# Altium project ip_phone.PrjPcb (part 2 of 2)

## Sheet ip_phone_f_power.SchDoc: Carregador e Fontes
size A3; SheetNumber: 6; SheetTotal: 6
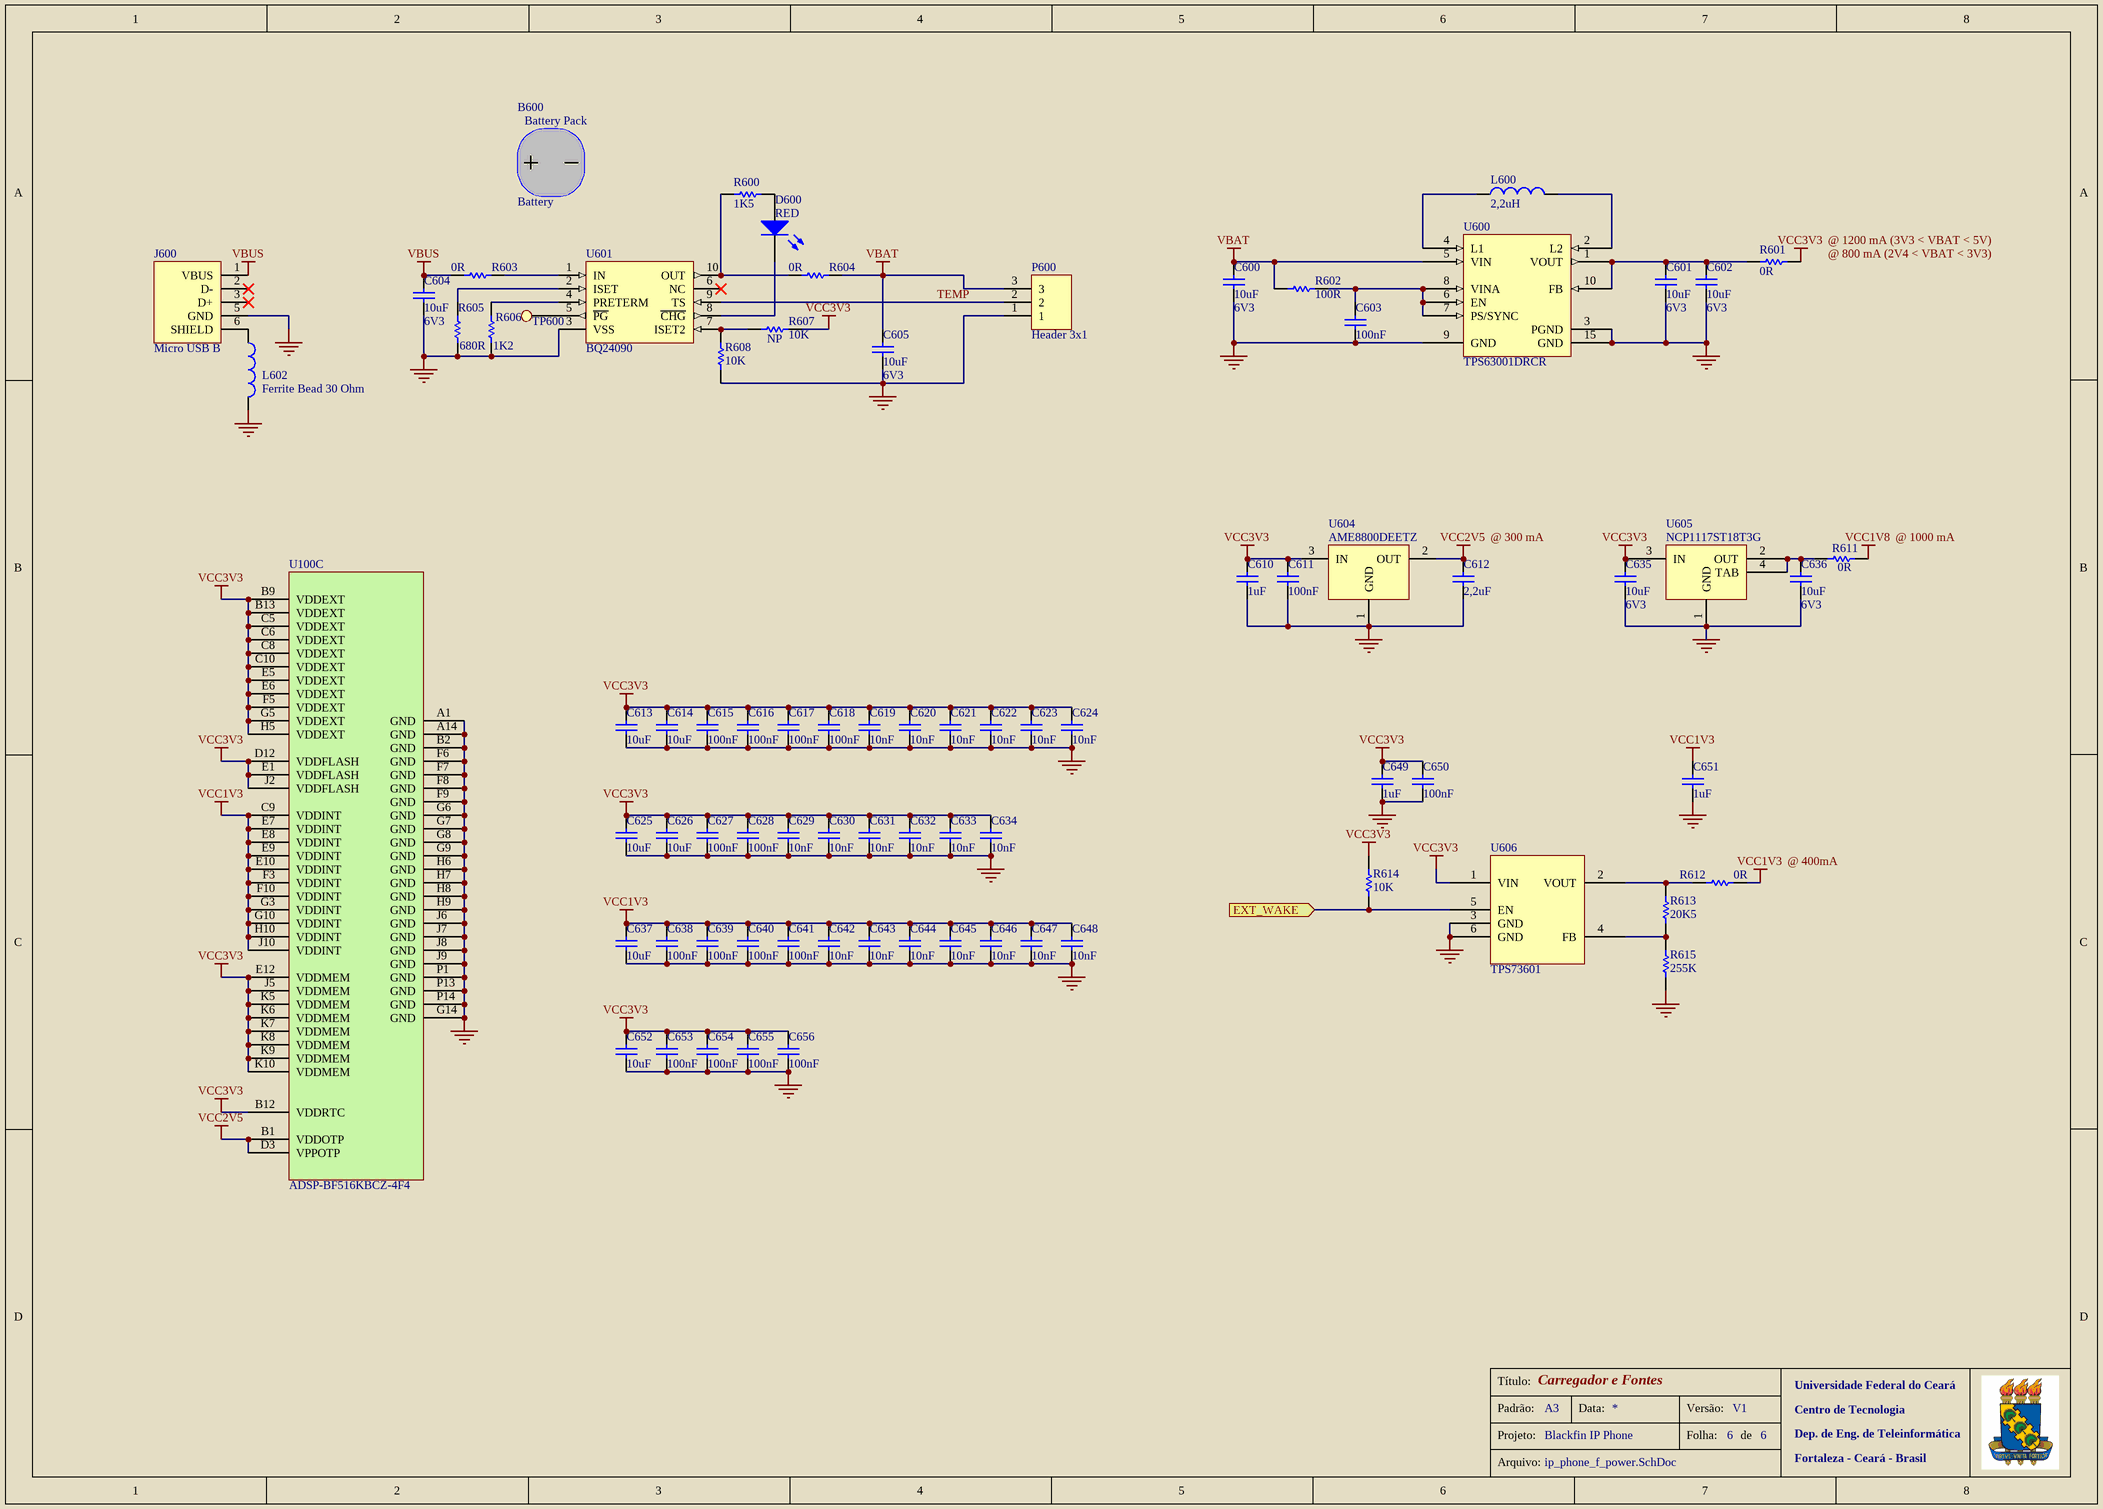
[diagram p5: ip_phone_f_power.SchDoc]

### Parts
B600  Battery  (mechanical)
C600  10uF  [CC1608-0603]
C601  10uF  [CC1608-0603]
C602  10uF  [CC1608-0603]
C603  100nF  [CC1005-0402]
C604  10uF  [CC1608-0603]
C605  10uF  [CC1608-0603]
C610  1uF  [CC1005-0402]
C611  100nF  [CC1005-0402]
C612  2,2uF  [CC1608-0603]
C613  10uF  [CC1608-0603]
C614  10uF  [CC1608-0603]
C615  100nF  [CC1005-0402]
C616  100nF  [CC1005-0402]
C617  100nF  [CC1005-0402]
C618  100nF  [CC1005-0402]
C619  10nF  [CC1005-0402]
C620  10nF  [CC1005-0402]
C621  10nF  [CC1005-0402]
C622  10nF  [CC1005-0402]
C623  10nF  [CC1005-0402]
C624  10nF  [CC1005-0402]
C625  10uF  [CC1608-0603]
C626  10uF  [CC1608-0603]
C627  100nF  [CC1005-0402]
C628  100nF  [CC1005-0402]
C629  10nF  [CC1005-0402]
C630  10nF  [CC1005-0402]
C631  10nF  [CC1005-0402]
C632  10nF  [CC1005-0402]
C633  10nF  [CC1005-0402]
C634  10nF  [CC1005-0402]
C635  10uF  [CC1608-0603]
C636  10uF  [CC1608-0603]
C637  10uF  [CC1608-0603]
C638  100nF  [CC1005-0402]
C639  100nF  [CC1005-0402]
C640  100nF  [CC1005-0402]
C641  100nF  [CC1005-0402]
C642  10nF  [CC1005-0402]
C643  10nF  [CC1005-0402]
C644  10nF  [CC1005-0402]
C645  10nF  [CC1005-0402]
C646  10nF  [CC1005-0402]
C647  10nF  [CC1005-0402]
C648  10nF  [CC1005-0402]
C649  1uF  [CC1005-0402]
C650  100nF  [CC1005-0402]
C651  1uF  [CC1005-0402]
C652  10uF  [CC1608-0603]
C653  100nF  [CC1005-0402]
C654  100nF  [CC1005-0402]
C655  100nF  [CC1005-0402]
C656  100nF  [CC1005-0402]
D600  RED  [LED_0603]
J600  Micro USB B  [Micro USB]
L600  2,2uH  [POWER INDUCTOR]
L602  Ferrite Bead 30 Ohm  [INDUTOR_0603]
P600  Header 3x1  [HEADER 3x1]
R600  1K5  [CR1608-0603]
R601  0R  [CR3225-1210]
R602  100R  [CR1608-0603]
R603  0R  [CR1608-0603]
R604  0R  [CR1608-0603]
R605  680R  [CR1005-0402]
R606  1K2  [CR1005-0402]
R607  10K  [CR1005-0402]
R608  10K  [CR1005-0402]
R611  0R  [CR3225-1210]
R612  0R  [CR1608-0603]
R613  20K5  [CR1005-0402]
R614  10K  [CR1005-0402]
R615  255K  [CR1005-0402]
TP600  Test Point  [Test Point]  (value not drawn)  (no BOM)
U100  ADSP-BF516KBCZ-4F4  [BGA168]  (part C of 3)
U600  TPS63001DRCR  [SON10]
U601  BQ24090  [MSOP10]
U604  AME8800DEETZ  [SOT-23]
U605  NCP1117ST18T3G  [SOT223]
U606  TPS73601  [SOT223 - 6P]

### Ports
EXT_WAKE (in)

### Nets
GND: C600.1 C601.1 C602.1 C603.1 C604.1 C605.1 C610.2 C611.1 C612.1 C613.1 C614.1 C615.1 C616.1 C617.1 C618.1 C619.1 C620.1 C621.1 C622.1 C623.1 C624.1 C625.1 C626.1 C627.1 C628.1 C629.1 C630.1 C631.1 C632.1 C633.1 C634.1 C635.1 C636.1 C637.1 C638.1 C639.1 C640.1 C641.1 C642.1 C643.1 C644.1 C645.1 C646.1 C647.1 C648.1 C649.2 C650.1 C651.2 C652.1 C653.1 C654.1 C655.1 C656.1 J600.5(GND) L602.2 P600.1 R605.1 R606.2 R608.2 R615.1 U100.A1(GND) U100.A14(GND) U100.B2(GND) U100.F6(GND) U100.F7(GND) U100.F8(GND) U100.F9(GND) U100.G6(GND) U100.G7(GND) U100.G8(GND) U100.G9(GND) U100.G14(GND) U100.H6(GND) U100.H7(GND) U100.H8(GND) U100.H9(GND) U100.J6(GND) U100.J7(GND) U100.J8(GND) U100.J9(GND) U100.P1(GND) U100.P13(GND) U100.P14(GND) U600.3(PGND) U600.9(GND) U600.15(GND) U601.3(VSS) U604.1(GND) U605.1(GND) U606.3(GND) U606.6(GND)  [project net AGND]
VBAT: C600.2 C605.2 P600.3 R602.2 R604.1 U600.5(VIN)
VBUS: C604.2 J600.1(VBUS) R603.2
VCC1V3: C637.2 C638.2 C639.2 C640.2 C641.2 C642.2 C643.2 C644.2 C645.2 C646.2 C647.2 C648.2 C651.1 R612.1 U100.C9(VDDINT) U100.E7(VDDINT) U100.E8(VDDINT) U100.E9(VDDINT) U100.E10(VDDINT) U100.F3(VDDINT) U100.F10(VDDINT) U100.G3(VDDINT) U100.G10(VDDINT) U100.H10(VDDINT) U100.J10(VDDINT)
VCC1V8: R611.2
VCC2V5: C612.2 U100.B1(VDDOTP) U100.D3(VPPOTP) U604.2(OUT)
VCC3V3: C610.1 C611.2 C613.2 C614.2 C615.2 C616.2 C617.2 C618.2 C619.2 C620.2 C621.2 C622.2 C623.2 C624.2 C625.2 C626.2 C627.2 C628.2 C629.2 C630.2 C631.2 C632.2 C633.2 C634.2 C635.2 C649.1 C650.2 C652.2 C653.2 C654.2 C655.2 C656.2 R601.2 R607.1 R614.1 U100.B9(VDDEXT) U100.B12(VDDRTC) U100.B13(VDDEXT) U100.C5(VDDEXT) U100.C6(VDDEXT) U100.C8(VDDEXT) U100.C10(VDDEXT) U100.D12(VDDFLASH) U100.E1(VDDFLASH) U100.E5(VDDEXT) U100.E6(VDDEXT) U100.E12(VDDMEM) U100.F5(VDDEXT) U100.G5(VDDEXT) U100.H5(VDDEXT) U100.J2(VDDFLASH) U100.J5(VDDMEM) U100.K5(VDDMEM) U100.K6(VDDMEM) U100.K7(VDDMEM) U100.K8(VDDMEM) U100.K9(VDDMEM) U100.K10(VDDMEM) U604.3(IN) U605.3(IN) U606.1(VIN)
EXT_WAKE: R614.2 U606.5(EN) ; port EXT_WAKE
TEMP: P600.2 U601.9(TS)
NetC601_2: C601.2 C602.2 R601.1 U600.1(VOUT) U600.10(FB)
NetC603_2: C603.2 R602.1 U600.6(EN) U600.7(PS/SYNC) U600.8(VINA)
NetC636_2: C636.2 R611.1 U605.2(OUT) U605.4(TAB)
NetD600_1: D600.1(A) R600.1
NetD600_2: D600.2(K) U601.8(~{CHG})
NetJ600_6: J600.6(SHIELD) L602.1
NetL600_1: L600.1 U600.4(L1)
NetL600_2: L600.2 U600.2(L2)
NetR600_2: R600.2 R604.2 U601.10(OUT)
NetR603_1: R603.1 U601.1(IN)
NetR605_2: R605.2 U601.2(ISET)
NetR606_1: R606.1 U601.4(PRETERM)
NetR607_2: R607.2 R608.1 U601.7(ISET2)
NetR612_2: R612.2 R613.2 U606.2(VOUT)
NetR613_1: R613.1 R615.2 U606.4(FB)
NetTP600_1: TP600.1 U601.5(~{PG})

Not connected (* = marked no-connect by the designer): J600 2(D-)* 3(D+)*; U601 6(NC)*

### Notes on the sheet
- (near R601) @ 1200 mA (3V3 < VBAT < 5V)
- (near C600) 6V3
- (near C601) 6V3
- (near C602) 6V3
- (near R601) @ 800 mA (2V4 < VBAT < 3V3)
- 6V3
- (near C605) 6V3
- (near C612) @ 300 mA
- (near R611) @ 1000 mA
- (near C636) 6V3
- @ 400mA
- Título:
- Universidade Federal do Ceará
- Padrão:
- Projeto:
- A3
- Blackfin IP Phone
- Data:
- Versão:
- Folha:
- V1
- de
- Centro de Tecnologia
- Dep. de Eng. de Teleinformática
- Fortaleza - Ceará - Brasil
- Arquivo:
- (in symbol Battery) Battery Pack

### Library data of the parts
B600 = Battery: Li-Polymer battery PL714065, 3.7V 2000mAh cell; eVendorPart#: PC-714065; eVendor: HOLY TECHNOLOGY; eVendorPrice: 3,51; MSRP: 3,05; Manufacturer: HOLY TECHNOLOGY; MOQ: 1000; Part#: PC-714065
C600-C602 C604 C605 C613 C614 C625 C626 C635-C637 C652 = Capacitor: Capacitor SMD/SMT 0603 10uF 6.3volts X5R 20%; eVendorPart#: 810-C2012Y5V1A106Z; Manufacturer: TDK; Part#: C2012Y5V1A106ZT; eVendor: Mouser; eVendorPrice: 0,14; MSRP: 0,033; MOQ: 1000
C603 C611 C615-C618 C627 C628 C638-C641 C650 C653-C656 = Capacitor: MLCC - SMD/SMT 0.1UF 16V 10% 0402; eVendorPart#: 810-C1005X7R1C104K; Manufacturer: TDK; Part#: C1005X7R1C104KT; eVendor: Mouser; eVendorPrice: 0,03; MSRP: 0,005; MOQ: 1000
C610 C649 C651 = Capacitor: CAP CER 1.0UF 6.3V 20% X5R 0402; eVendorPart#: 490-1319-1-ND; Manufacturer: Murata Electronics North America; Part#: GRM155R60J105ME19D; eVendor: Digikey; eVendorPrice: 0,055; MSRP: 0,01193; MOQ: 1000
C612 = Capacitor: Capacitor SMD/SMT 0603 2.2uF 10volts Y5V +80-20%; eVendorPart#: 81-GRM188F51A225ZE01; Manufacturer: Murata; Part#: GRM188F51A225ZE01D; eVendor: Mouser; eVendorPrice: 0,17; MSRP: 0,04; MOQ: 1000
C619-C624 C629-C634 C642-C648 = Capacitor: Capacitor SMD/SMT 0402 0.01uF 16volts X7R 10%; eVendorPart#: 810-C1005X7R1C103K; Manufacturer: TDK; Part#: C1005X7R1C103KT; eVendor: Mouser; eVendorPrice: 0,03; MSRP: 0,004; MOQ: 1000
D600 = LED: Part#: APT1608SURCK; Manufacturer: Kingbright; eVendorPart#: 604-APT1608SURCK; eVendor: Mouser; eVendorPrice: 0,16; MSRP: 0,06; MOQ: 1000
J600 = CON_Micro_USB: USB Connectors 5P Quick Connect Micro USB TypeB Rcpt; Manufacturer: FCI; Part#: 10103594-0001LF; eVendorPart#: 649-10103594-0001LF; eVendor: Mouser; eVendorPrice: 0,45; MSRP: 0,306; MOQ: 1000
L600 = Inductor: IND POWER 2.2UH 1.5A SMD; eVendorPart#: 445-3233-1-ND; Manufacturer: TDK; Part#: VLF4012AT-2R2M1R5; eVendor: Digikey; eVendorPrice: 0,77; MSRP: 0,495; MOQ: 500
L602 = Inductor: EMI/RFI Suppressors & Ferrites 0603 30 OHM; eVendorPart#: 81-BLM11P300S; Manufacturer: Murata; Part#: BLM18PG300SN1D; eVendor: Mouser; eVendorPrice: 0,19; MSRP: 0,041; MOQ: 1000
P600 = CON_HEADER_3x1: CONN HEADER 3POS 2.5MM R/A SMD; Manufacturer: JST Sales America Inc; Part#: S3B-XH-SM4-TB(LF)(SN); eVendorPart#: 455-2263-1-ND; eVendor: Digikey; eVendorPrice: 0,67; MSRP: 0,5125; MOQ: 100
R600 = Resistor: Thick Film Resistors 1.5KOHM 5% 1/10W; eVendorPart#: 52-CR0603-JW-152GLF; Manufacturer: Bourns; Part#: CR0603-JW-152GLF; eVendor: Mouser; eVendorPrice: 0,02; MSRP: 0,008; MOQ: 1000
R601 R611 = Resistor: Thick Film Resistors ZERO OHM JUMPER 1210; eVendorPart#: 660-RK73Z2ETTD; Manufacturer: KOA Speer; Part#: RK73Z2ETTD; eVendor: Mouser; eVendorPrice: 0,14; MSRP: 0,08; MOQ: 1000
R602 = Resistor: Thick Film Resistors 1/16WATT 100R 0402; eVendorPart#: 652-CR0603-JW-101GLF; Manufacturer: Bourns; Part#: CR0603-JW-101GLF; eVendor: Mouser; eVendorPrice: 0,06; MSRP: 0,01; MOQ: 1000
R603 R604 R612 = Resistor: Thick Film Resistors ZERO OHM; eVendorPart#: 652-CR0603-J/-000ELF; Manufacturer: Bourns; Part#: CR0603-J/-000ELF; eVendor: Mouser; eVendorPrice: 0,02; MSRP: 0,008; MOQ: 1000
R605 = Resistor: Thick Film Resistors SMD 0402 680 5%  1/16 W; eVendorPart#: 311-680JRCT-ND; Manufacturer: Yageo; Part#: RC0402JR-07680RL; eVendor: Digikey; eVendorPrice: 0,012; MSRP: 0,00253; MOQ: 1000
R606 = Resistor: Thick Film Resistors SMD 0402 1K2 5%  1/16 W; eVendorPart#: 311-1.2KJRCT-ND; Manufacturer: Yageo; Part#: RC0402JR-071K2L; eVendor: Digikey; eVendorPrice: 0,012; MSRP: 0,00253; MOQ: 1000
R607 R608 R614 = Resistor: Thick Film Resistors SMD 0402 10k 5%  1/16 W; eVendorPart#: 311-10KJRCT-ND; Manufacturer: Yageo; Part#: RC0402JR-0710KL; eVendor: Digikey; eVendorPrice: 0,012; MSRP: 0,00253; MOQ: 1000
  R607: NP: NP
R613 = Resistor: RES 20.5K OHM 1/10W 1% 0402 SMD; eVendorPart#: P20.5KLCT-ND; Manufacturer: Panasonic - ECG; Part#: ERJ-2RKF2052X; eVendor: Digikey; eVendorPrice: 0,06; MSRP: 0,00672; MOQ: 1000
R615 = Resistor: RES 255K OHM 1/10W 1% 0402 SMD; eVendorPart#: P255KLCT-ND; Manufacturer: Panasonic - ECG; Part#: ERJ-2RKF2553X; eVendor: Digikey; eVendorPrice: 0,06; MSRP: 0,00672; MOQ: 1000
TP600 = Test Point: eVendor: NÃO SE APLICA; eVendorPrice: 0,00; eVendorPart#: NÃO SE APLICA; Part#: NÃO SE APLICA; Manufacturer: NÃO SE APLICA; MOQ: 1000; MSRP: 0,00
U100 = ADSP-BF516KBCZ-4F4: Low Power Blackfin with Advanced Embedded Connectivity; Manufacturer: Analog Device; eVendor: Avnet; eVendorPrice: 19,42; MSRP: 14,15; eVendorPart#: ADSP-BF516KBCZ-4F4; MOQ: 500; Part#: ADSP-BF516KBCZ-4F4
U600 = TPS63001DRCR: HIGH EFFICIENT SINGLE INDUCTOR BUCK-BOOST CONVERTER WITH 1.8-A SWITCHES; eVendorPart#: 296-19643-1-ND; Manufacturer: Texas Instruments; eVendor: Digikey; eVendorPrice: 4,5; MSRP: 2,25; MOQ: 1000; Part#: TPS63001DRCR
U601 = BQ24090: 1A,Sgl Inp,Sgl Cell Li-Ion Batt Charger; Manufacturer: Texas Instruments; Part#: BQ24090DGQT; eVendorPart#: 595-BQ24090DGQT; eVendor: Mouser; eVendorPrice: 2,76; MSRP: 1,16; MOQ: 1000
U604 = AME8800DEETZ: Low Dropout (LDO) Regulators 2.5V 300mA CMOS; eVendorPart#: 827-AME8800DEETZ; Manufacturer: AME; eVendor: Mouser; eVendorPrice: 0,67; MSRP: 0,171; MOQ: 1000; Part#: AME8800DEETZ
U605 = NCP1117ST18T3G: Low Dropout (LDO) Regulators 1.8V 1A Positive; eVendorPart#: 863-NCP1117ST18T3G; Manufacturer: ON Semiconductor; eVendor: Mouser; eVendorPrice: 0,35; MSRP: 0,171; Part#: NCP1117ST18T3G; MOQ: 1000
U606 = TPS73601: LDO Regulator; Part#: TPS73601DCQR; eVendorPart#: 595-TPS73601DCQR; Manufacturer: Texas Instruments; eVendor: Mouser; eVendorPrice: 2,25; MSRP: 1,17; MOQ: 1000

## Nets that join several sheets
AGND: ip_phone_a_sdram (21 pins), ip_phone_b_miscellaneous (22 pins), ip_phone_c_codec (24 pins), ip_phone_d_lcd_keyboard (11 pins), ip_phone_e_wifi (35 pins), ip_phone_f_power (91 pins)
VBAT: ip_phone_c_codec (R315.1), ip_phone_f_power (6 pins)
VCC1V8: ip_phone_c_codec (C313.1 J302.2 U301.4), ip_phone_e_wifi (18 pins), ip_phone_f_power (R611.2)
VCC3V3: ip_phone_a_sdram (20 pins), ip_phone_b_miscellaneous (30 pins), ip_phone_c_codec (12 pins), ip_phone_d_lcd_keyboard (6 pins), ip_phone_e_wifi (17 pins), ip_phone_f_power (61 pins)
~{KEYPAD_INT}: ip_phone_b_miscellaneous (U100.D1), ip_phone_d_lcd_keyboard (R406.1)
~{RESET}: ip_phone_a_sdram (U100.B10), ip_phone_b_miscellaneous (D200.2 J201.9 R201.1 U200.2), ip_phone_d_lcd_keyboard (R407.1)
EXT_WAKE: ip_phone_a_sdram (U100.B14), ip_phone_f_power (R614.2 U606.5)
JACK_EN: ip_phone_c_codec (CON301.5 R310.1 R317.2 U301.12), ip_phone_d_lcd_keyboard (R409.1)
MCLK: ip_phone_a_sdram (U100.A11), ip_phone_c_codec (R326.2)
SCL: ip_phone_b_miscellaneous (R206.2 R237.2), ip_phone_c_codec (R319.1 R327.2), ip_phone_d_lcd_keyboard (R401.1 R404.1)
SDA: ip_phone_b_miscellaneous (R207.2 R238.2), ip_phone_c_codec (R320.1 R328.2), ip_phone_d_lcd_keyboard (R403.1 R405.1)
SDIO_0: ip_phone_b_miscellaneous (U100.L2), ip_phone_e_wifi (R504.2 U500.11)
SDIO_1: ip_phone_b_miscellaneous (U100.M1), ip_phone_e_wifi (R505.2 U500.12)
SDIO_2: ip_phone_b_miscellaneous (U100.L1), ip_phone_e_wifi (R506.2 U500.13)
SDIO_3: ip_phone_b_miscellaneous (U100.K1), ip_phone_e_wifi (R507.2 U500.14)
SDIO_CLK: ip_phone_b_miscellaneous (U100.K2), ip_phone_e_wifi (R502.2 U500.9)
SDIO_CMD: ip_phone_b_miscellaneous (U100.K3), ip_phone_e_wifi (R503.2 U500.10)
SPK/~{HP}: ip_phone_c_codec (R306.1 U300.4 U300.8), ip_phone_d_lcd_keyboard (R408.1)
SPORT_CLK: ip_phone_b_miscellaneous (R204.2 U100.A6), ip_phone_c_codec (R312.2)
SPORT_FS: ip_phone_b_miscellaneous (R202.2 U100.B8), ip_phone_c_codec (R311.2)
SPORT_RX: ip_phone_b_miscellaneous (U100.B6), ip_phone_c_codec (R308.2)
SPORT_TX: ip_phone_b_miscellaneous (U100.B7), ip_phone_c_codec (R309.2)
WIFI_CS: ip_phone_b_miscellaneous (U100.F2), ip_phone_e_wifi (R516.1 U502.11)
WIFI_INT: ip_phone_b_miscellaneous (R218.1), ip_phone_e_wifi (R515.1 U502.10)
WL_DBG: ip_phone_b_miscellaneous (U100.E2), ip_phone_e_wifi (R519.1 U502.14)
WL_RX: ip_phone_b_miscellaneous (U100.A10), ip_phone_e_wifi (R517.1 U502.12)
WL_TX: ip_phone_b_miscellaneous (U100.A9), ip_phone_e_wifi (R518.1 U502.13)